# Altium schematic sheet pH.SchDoc
size A
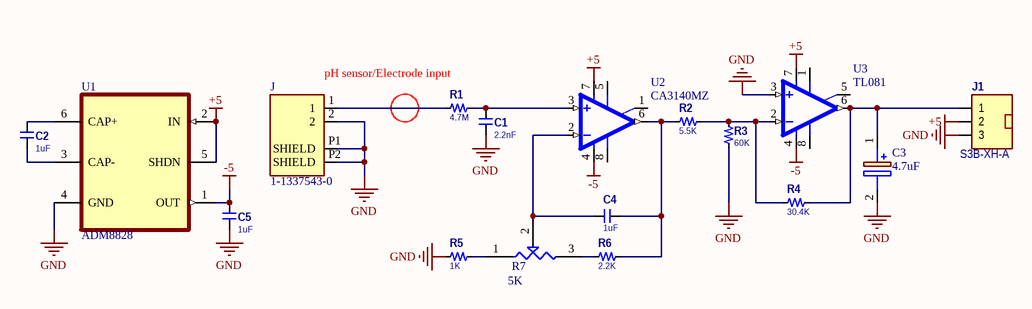
[diagram p0: pH.SchDoc]

## Parts
C1  2.2nF  [0805-C_N]
C2  1uF  [0805-C_N]
C3  4.7uF  [CAPPM7344X430N]
C4  1uF  [0805-C_N]
C5  1uF  [0805-C_N]
J  1-1337543-0  [CONN_1-1337543-0]
J1  S3B-XH-A  [CON_HDR1x3_2p50_RA_SHRD_JST-S3B-XH-A]
R1  4.7M  [0603-R_N]
R2  5.5K  [0603-R_N]
R3  60K  [0603-R_N]
R4  30.4K  [0603-R_N]
R5  1K  [0603-R_N]
R6  2.2K  [0603-R_N]
R7  5K  [TRIM_PV37W502C01B00]
U1  ADM8828  [SOT-23-6]
U2  CA3140MZ  [SOIC127P600X175-8N]
U3  TL081  [SOIC127P600X175-8N]

## Nets
+5: J1.2 U1.2(IN) U1.5(SHDN) U2.7(V+) U3.7(V+)
-5: C5.1 U1.1(OUT) U2.4(V-) U3.4(V-)
GND: C1.2 C3.2(-) C5.2 J.2 J.P1(SHIELD) J.P2(SHIELD) J1.3 R3.1 R5.1 U1.4(GND) U3.3(+IN)
NetC1_1: C1.1 R1.2 U2.3(+IN)
NetC2_1: C2.1 U1.6(CAP+)
NetC2_2: C2.2 U1.3(CAP-)
NetC3_1: C3.1(+) J1.1 R4.2 U3.6(OUT)
NetC4_1: C4.1 R7.2 U2.2(-IN)
NetC4_2: C4.2 R2.1 R6.2 U2.6(OUT)
NetJ_1: J.1 R1.1
NetR2_2: R2.2 R3.2 R4.1 U3.2(-IN)
NetR5_2: R5.2 R7.1
NetR6_1: R6.1 R7.3

Not connected (* = marked no-connect by the designer): U2 1(ON/CMP) 5(ON) 8(CMP); U3 1(ON1) 5(ON2) 8(OPT)

## Notes on the sheet
- pH sensor/Electrode input

## Library data of the parts
C1 C2 C4 C5 = CAP CER 1000PF 50V X7R 0805_(F5.1.2): CAP CER 1000PF 50V X7R 0805; Manufacturer: Panasonic; Manufacturer Part Number: ECJ2VB1H102K; Capacitance: 1nF; Tolerance: 10%; ComponentLink1URL: https://search.murata.co.jp/Ceramy/image/img/A01X/G101/ENG/GRM188C81E105KAAD-01A.pdf; ComponentLink1Description: Datasheet; ComponentLink2URL: https://datasheet.ciiva.com/25733/cl21b105kofnnwe-25733265.pdf?src-supplier=Digi-Key; ComponentLink2Description: https://datasheet.ciiva.com/25733/cl21b105kofnnwe-25733265.pdf?src-supplier=Digi-Key; ComponentLink3URL: https://api.kemet.com/component-edge/download/datasheet/C0805C474K5RECAUTO.pdf?src-supplier=Digi-Key; ComponentLink3Description: https://api.kemet.com/component-edge/download/datasheet/C0805C474K5RECAUTO.pdf?src-supplier=Digi-Key; ComponentLink4URL: https://datasheet.ciiva.com/6266/ecjhighcapacitance-6266926.pdf?src-supplier=Digi-Key; ComponentLink4Description: https://datasheet.ciiva.com/6266/ecjhighcapacitance-6266926.pdf?src-supplier=Digi-Key; Supplier 1: Arrow Electronics; RoHS: Yes; Category: Ceramic Capacitors; Mount: Surface Mount; Case/Package: 0805; Weight: 0.01lb; Case Code (Metric): 2012; Case Code (Imperial): 0805; Min Operating Temperature: -55°C; Max Operating Temperature: 125°C; Package Quantity: 5000; Voltage Rating: 50V; Packaging: Tape and Reel; Dielectric: X7R; Voltage Rating (DC): 50V; Length: 0.079inch; Width: 0.049inch; Height: 0.25inch; Thickness: 0.028inch; Depth: 1.25mm; Lead Free: Contains Lead; RoHS Compliant: Yes; ComponentLink5URL: https://datasheet.ciiva.com/6268/ecj-general-6268310.pdf?src-supplier=Digi-Key; ComponentLink5Description: https://datasheet.ciiva.com/6268/ecj-general-6268310.pdf?src-supplier=Digi-Key; ComponentLink6URL: https://datasheet.ciiva.com/6268/ecj-general-6268313.pdf?src-supplier=Digi-Key; ComponentLink6Description: https://datasheet.ciiva.com/6268/ecj-general-6268313.pdf?src-supplier=Digi-Key; ComponentLink7URL: https://datasheet.ciiva.com/6268/ecj-general-6268317.pdf?src-supplier=Digi-Key; ComponentLink7Description: https://datasheet.ciiva.com/6268/ecj-general-6268317.pdf?src-supplier=Digi-Key; Supplier Part Number 1: ECJ-2VB1H102K
C3 = 220 uf Tantalun: Capacitor Polarised; Manufacturer_Name: AVX; Manufacturer_Part_Number: TAJE227K010RNJ; Datasheet Link: http://datasheets.avx.com/TAJ.pdf; Height: 4.3mm; Mouser Part Number: 581-TAJE227K010R; Mouser Price/Stock: https://www.mouser.co.uk/ProductDetail/AVX/TAJE227K010RNJ?qs=A5TU6qcA1mE1rnfBa9dexw%3D%3D; Arrow Part Number: TAJE227K010RNJ; Arrow Price/Stock: https://www.arrow.com/en/products/taje227k010rnj/avx
J = 1-1337543-0: Conn ZDC/BNC RCP 0Hz to 4GHz 50Ohm Solder RA Thru-Hole Gold Over Nickel Over Copper Individual; MF: TE Connectivity; Number_of_Positions: 1; Package: None; Price: None; Availability: Unavailable; MP: 1-1337543-0; TE_purchase_URL: https://www.te.com/usa-en/product-1-1337543-0.html?te_bu=Cor&te_type=disp&te_campaign=seda_glo_cor-seda-global-disp-prtnr-fy19-seda-model-bom-cta_sma-317_1&elqCampaignId=32493; SnapEDA_Link: https://www.snapeda.com/parts/1-1337543-0/TE%20Connectivity%20AMP%20Connectors/view-part/490820/?ref=snap; Value: *
J1 = CON_HDR1x3_2p50_RA_SHRD_JST_S3B-XH-A: Conn Shrouded Header (4 Sides) HDR 3 POS 2.5mm Solder RA Side Entry Thru-Hole Box; Manufacturer: JST; Manufacturer Part Number: S3B-XH-A(LF)(SN); Contact Resistance: 20mR; Current Rating: 3A; Voltage Rating (AC): 250V; Number of Positions: 3; Insulation Resistance: 1GR; Gender: Male; Connector Type: Male Pin; Wire/Cable Gauge: 22AWG; ComponentLink4Description: Datasheet; ComponentLink4URL: http://www.jst-mfg.com/product/pdf/eng/eXH.pdf; Supplier 1: Digi-Key; RoHS: Yes; Category: Headers and Wire Housings; Stock 1: 12903; Pricing 1: 1=0.22000, 10=0.20400, 100=0.14140, 500=0.11968, 1000=0.09792, 5000=0.08704, 10000=0.07888 (USD); Mount: Through Hole; Contact Plating: Tin,Lead,Copper; Contact Material: Brass; Color: Natural; Housing Color: White; Housing Material: Polyamide; Min Operating Temperature: -25°C; Max Operating Temperature: 85°C; Number of Rows: 1; Package Quantity: 1000; Packaging: Bulk; Max Current Rating: 3A; Voltage Rating: 250V; Termination: Press-Fit; Number of Contacts: 3; Max Voltage Rating (AC): 250V; Orientation: Right Angle; Length: 9.9mm; Lead Pitch: 2.5mm; Pitch: 2.5mm; Depth: 11.5mm; REACH SVHC: No SVHC; Lead Free: Lead Free; Supplier Part Number 1: 455-2250-ND
R1-R6 = R_11K OHM 1% 1/10W 0603: 11 kOhms ±1% 0.1W, 1/10W Chip Resistor 0603 (1608 Metric) Automotive AEC-Q200 Thick Film; Manufacturer: Panasonic; Manufacturer Part Number: ERJ-3EKF1102V; Resistance: 11kR; Voltage Rating: 75V; Temperature Coefficient: 100ppm/°C; Max Power Dissipation: 100mW; Voltage Rating (DC): 50V; ComponentLink1URL: https://industrial.panasonic.com/cdbs/www-data/pdf/RDO0000/AOA0000C331.pdf; ComponentLink1Description: Datasheet; Supplier 1: Digi-Key; Stock 1: 1618997; Pricing 1: 1 = 0.10000, 10 = 0.03200, 100 = 0.01300, 1000 = 0.00583, 2500 = 0.00506 (USD); RoHS: Yes; Mount: Surface Mount; Case Code (Imperial): 0603; Case Code (Metric): 1608; Contact Plating: Tin; Min Operating Temperature: -55°C; Max Operating Temperature: 155°C; Tolerance: 1%; Packaging: Tape and Reel; Package Quantity: 1; Termination: SMD/SMT; Resistor Type: Thick Film; Number of Terminations: 2; Features: Automotive AEC-Q200; Series: ERJ; Resistance Tolerance: 1%; Construction: Rectangular; Length: 1.6mm; Width: 0.8mm; Height: 0.022inch; Depth: 0.8mm; Radiation Hardening: No; REACH SVHC: No SVHC; Military Standard: Not; Lead Free: Lead Free; RoHS Compliant: Yes; ComponentLink2URL: https://datasheet.ciiva.com/28676/1678782-28676965.pdf?src-supplier=Element14; ComponentLink2Description: https://datasheet.ciiva.com/28676/1678782-28676965.pdf?src-supplier=Element14; ComponentLink3URL: https://datasheet.ciiva.com/24069/aoa0000ce2-24069096.pdf?src-supplier=Mouser; ComponentLink3Description: https://datasheet.ciiva.com/24069/aoa0000ce2-24069096.pdf?src-supplier=Mouser; ComponentLink4URL: https://datasheet.ciiva.com/28577/1678782-28577723.pdf?src-supplier=Element14; ComponentLink4Description: https://datasheet.ciiva.com/28577/1678782-28577723.pdf?src-supplier=Element14; ComponentLink5URL: https://datasheet.ciiva.com/46387/426256-46387019.pdf?src-supplier=Element14; ComponentLink5Description: https://datasheet.ciiva.com/46387/426256-46387019.pdf?src-supplier=Element14; ComponentLink6URL: https://datasheet.ciiva.com/9193/aoa0000ce2-9193884.pdf?src-supplier=Avnet; ComponentLink6Description: https://datasheet.ciiva.com/9193/aoa0000ce2-9193884.pdf?src-supplier=Avnet; ComponentLink7URL: https://datasheet.ciiva.com/15158/getdatasheetpartid-247528-15158908.pdf?src-supplier=Verical; ComponentLink7Description: https://datasheet.ciiva.com/15158/getdatasheetpartid-247528-15158908.pdf?src-supplier=Verical; ComponentLink8URL: https://datasheet.ciiva.com/16780/70260748-16780829.pdf?src-supplier=Allied+Electronics; ComponentLink8Description: https://datasheet.ciiva.com/16780/70260748-16780829.pdf?src-supplier=Allied+Electronics; ComponentLink9URL: https://datasheet.ciiva.com/46374/426256-46374157.pdf?src-supplier=Element14; ComponentLink9Description: https://datasheet.ciiva.com/46374/426256-46374157.pdf?src-supplier=Element14; ComponentLink10URL: https://datasheet.ciiva.com/43460/426256-43460542.pdf?src-supplier=Farnell; ComponentLink10Description: https://datasheet.ciiva.com/43460/426256-43460542.pdf?src-supplier=Farnell; Supplier Part Number 1: P11.0KHCT-ND; Power Rating: 100mW; Case/Package: 0603
R7 = PV37W502C01B00: Res Cermet Trimmer 5K Ohm 10% 0.25W(1/4W) 12(Elec)Turns 1.78mm (6.71 X 4.5 X 8.26mm) Pin Thru-Hole Tube; MF: Murata Electronics; Price: None; Value: *; Check_prices: https://www.snapeda.com/parts/PV37W502C01B00/Murata/view-part/?ref=eda; Package: PV37W Murata; Availability: Not in stock; SnapEDA_Link: https://www.snapeda.com/parts/PV37W502C01B00/Murata/view-part/?ref=snap; MP: PV37W502C01B00
U1 = ADM8828: Switched-Capacitor / Voltage Inverter with Shutdown; MF: Analog Devices; Availability: Unavailable; Package: SOT-23-6 Analog Devices; Price: None; Value: *
U2 = CA3140MZ: General Purpose Amplifier 1 Circuit 8-SOIC; MF: Renesas Electronics; Availability: Unavailable; Price: None; MP: CA3140MZ; Package: SOIC-8 Intersil; SnapEDA_Link: https://www.snapeda.com/parts/CA3140MZ/Renesas%20Electronics%20America%20Inc./view-part/105358/?ref=snap; Value: *
U3 = TL081: J-FET Amplifier 1 Circuit - 8-SOIC; MF: STMicroelectronics; Availability: In Stock; SnapEDA_Link: https://www.snapeda.com/parts/TL081/STMicroelectronics/view-part/?ref=snap; Check_prices: https://www.snapeda.com/parts/TL081/STMicroelectronics/view-part/?ref=eda; Price: None; Package: SOIC-8 STMicroelectronics; Purchase-URL: https://pricing.snapeda.com/search/part/TL081/?ref=eda; MP: TL081; Value: *